# EAGLE design Rx (EAGLE 8.1.1)
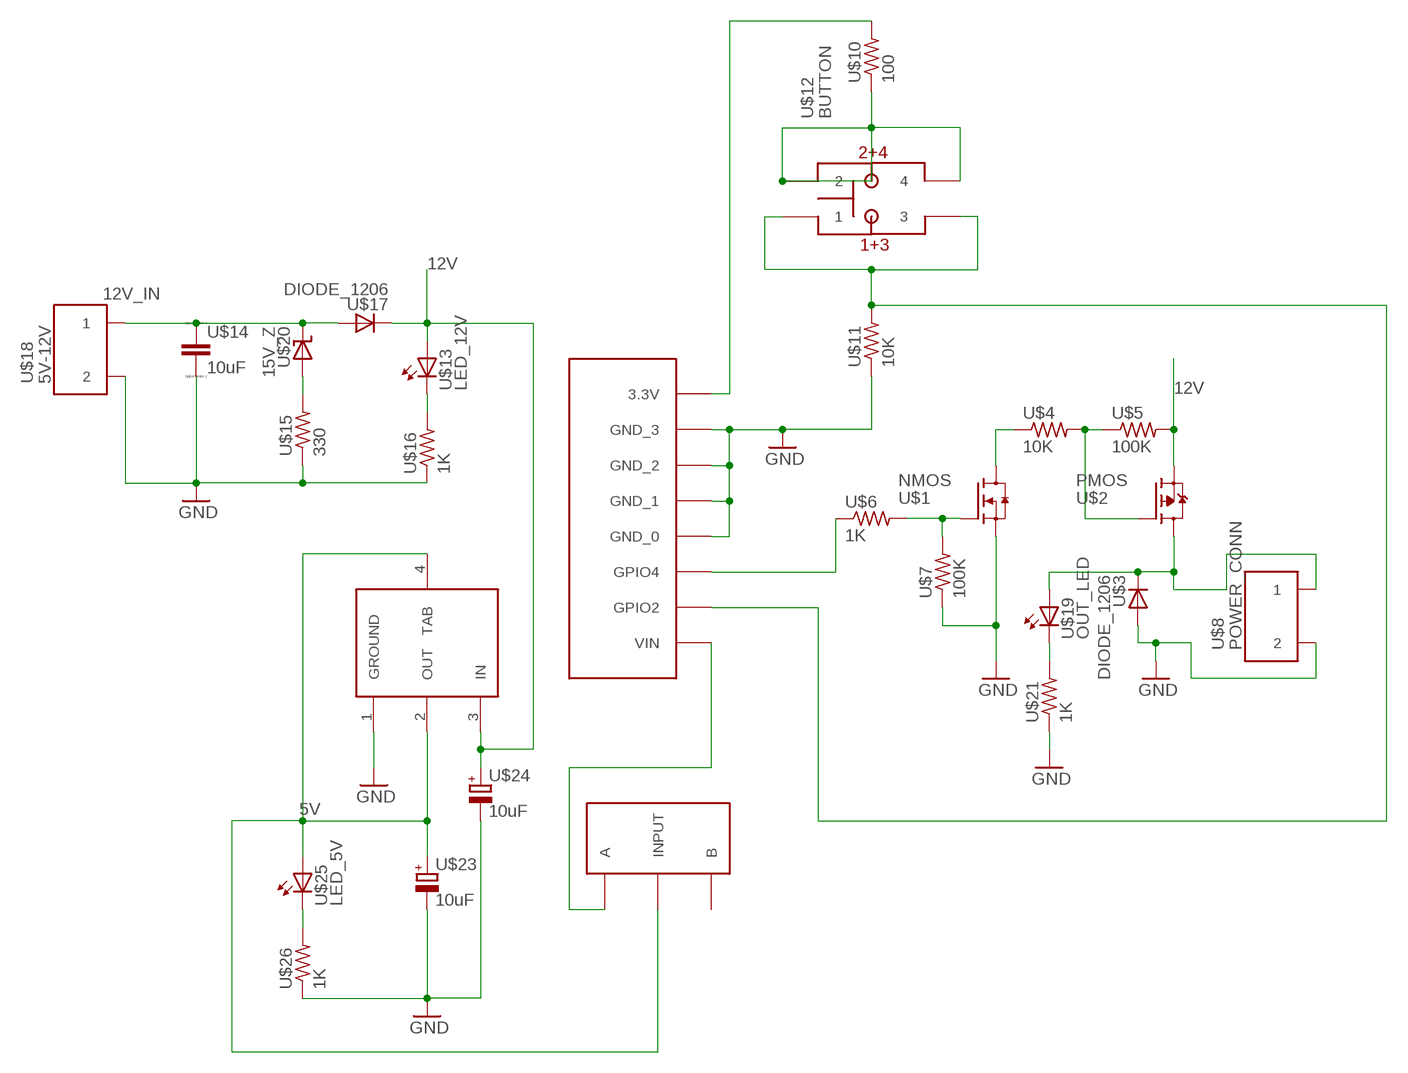
[diagram p0: schematic, sheet 1]

## Parts
U$1  NMOS  [SOT23]
U$2  PMOS  [D-PAK_TO252AA]
U$3  DIODE_1206  [DIDOE_1206]
U$4  10K  RES  [R1206]
U$5  100K  RES  [R1206]
U$6  1K  RES  [R1206]
U$7  100K  RES  [R1206]
U$8  POWER_CONN  [PC_1935161]
U$9  ESP8266  [ESP]
U$10  100  RES  [R1206]
U$11  10K  RES  [R1206]
U$12  BUTTON  [BUTTON]
U$13  LED_12V  LED_1206  [LED_1206]
U$14  10uF  CAP  [C1206]
U$15  330  RES  [R1206]
U$16  1K  RES  [R1206]
U$17  DIODE_1206  [DIDOE_1206]
U$18  5V-12V  POWER_CONN  [PC_1935161]
U$19  OUT_LED  LED_1206  [LED_1206]
U$20  15V_Z  DIODE_Z_1005  [Z_1005]
U$21  1K  RES  [R1206]
U$22  5V_REG  [SOT223]
U$23  10uF  CAP_POL  [153CLV-0405]
U$24  10uF  CAP_POL  [153CLV-0405]
U$25  LED_5V  LED_1206  [LED_1206]
U$26  1K  RES  [R1206]
U$27  SPDT  [SPDT]

## Nets
5V: U$22.2(OUT) U$22.4(TAB) U$23.+ U$25.1(HI) U$27.IN(INPUT)
12V: U$2.3(S) U$5.2 U$13.1(HI) U$17.2(LO) U$22.3(IN) U$24.+
12V_IN: U$14.1 U$17.1(HI) U$18.1 U$20.2(LO)
GND: U$1.2(S) U$3.1(HI) U$7.1 U$8.2 U$9.GND_0 U$9.GND_1 U$9.GND_2 U$9.GND_3 U$11.1 U$14.2 U$15.1 U$16.1 U$18.2 U$21.1 U$22.1(GROUND) U$23.- U$24.- U$26.1
N$1: U$1.1(G) U$6.2 U$7.2
N$2: U$6.1 U$9.GPIO4
N$3: U$1.3(D) U$4.1
N$4: U$2.1(G) U$4.2 U$5.1
N$5: U$19.2(LO) U$21.2
N$6: U$2.4(D) U$3.2(LO) U$8.1 U$19.1(HI)
N$7: U$9.GPIO2 U$11.2 U$12.1 U$12.3
N$8: U$25.2(LO) U$26.2
N$9: U$10.1 U$12.2 U$12.4
N$10: U$9.3.3_1(3.3V) U$10.2
N$11: U$13.2(LO) U$16.2
N$12: U$15.2 U$20.1(HI)
N$13: U$9.VIN U$27.A
Unconnected: U$27.B

## Library data of the parts
U$1 = Gas_Sensor_Lib_v1:NMOS
U$2 = Gas_Sensor_Lib_v1:PMOS
U$3 U$17 = Gas_Sensor_Lib_v1:DIODE_1206
U$4-U$7 U$10 U$11 U$15 U$16 U$21 U$26 = Gas_Sensor_Lib_v1:RES
U$8 U$18 = Gas_Sensor_Lib_v1:POWER_CONN
U$9 = Gas_Sensor_Lib_v1:ESP8266
U$12 = Gas_Sensor_Lib_v1:BUTTON
U$13 U$19 U$25 = Gas_Sensor_Lib_v1:LED_1206
U$14 = Gas_Sensor_Lib_v1:CAP
U$20 = Gas_Sensor_Lib_v1:DIODE_Z_1005
U$22 = Gas_Sensor_Lib_v1:5V_REG
U$23 U$24 = Gas_Sensor_Lib_v1:CAP_POL
U$27 = Gas_Sensor_Lib_v1:SPDT

## Board
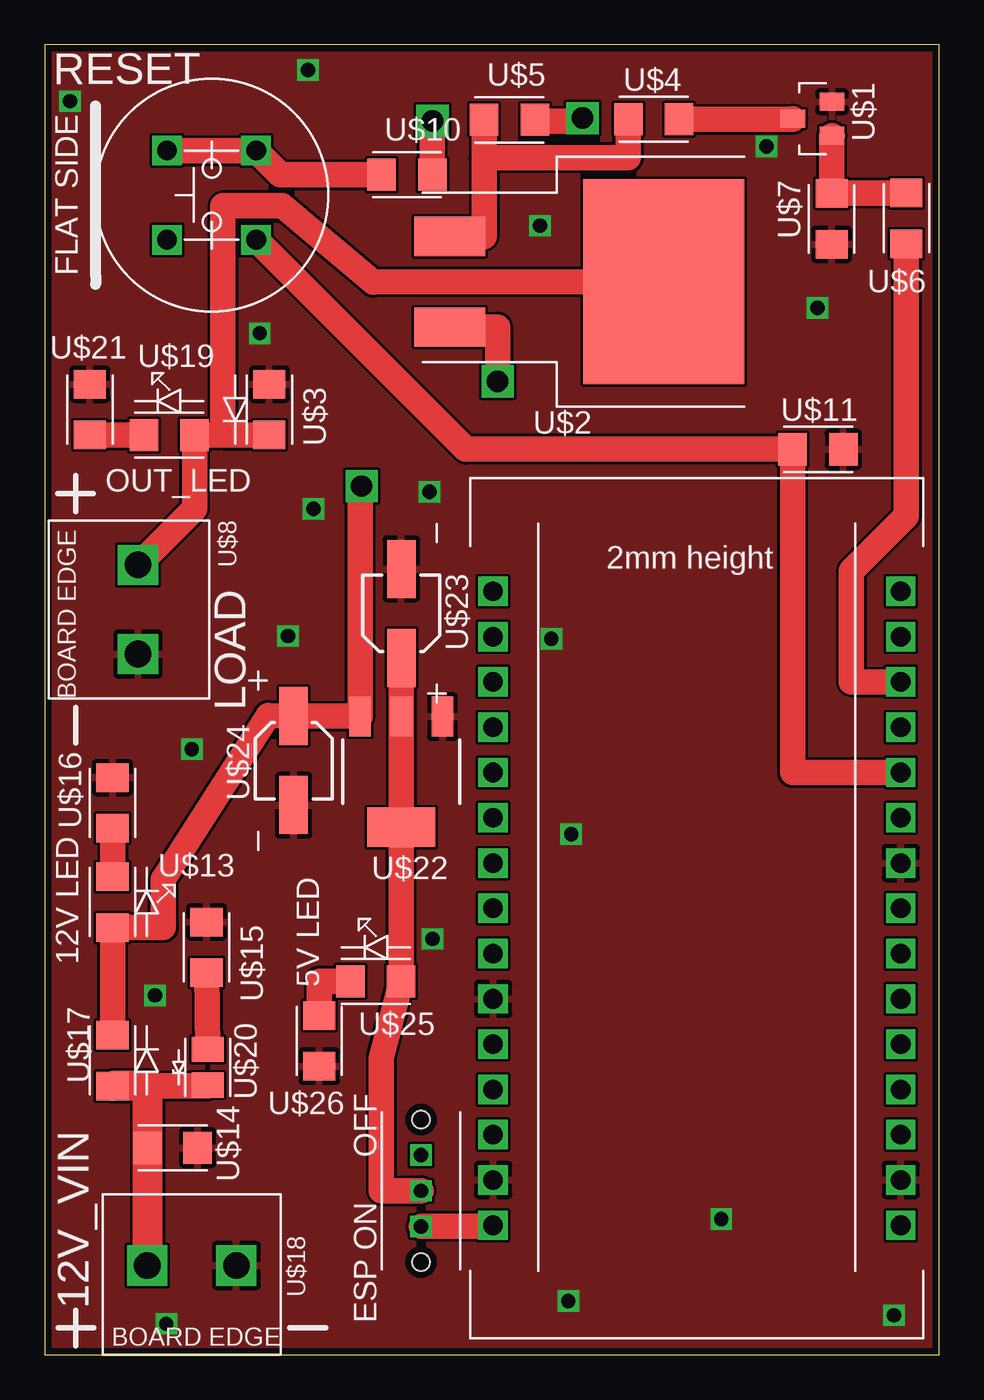
[diagram p1: board, top side]
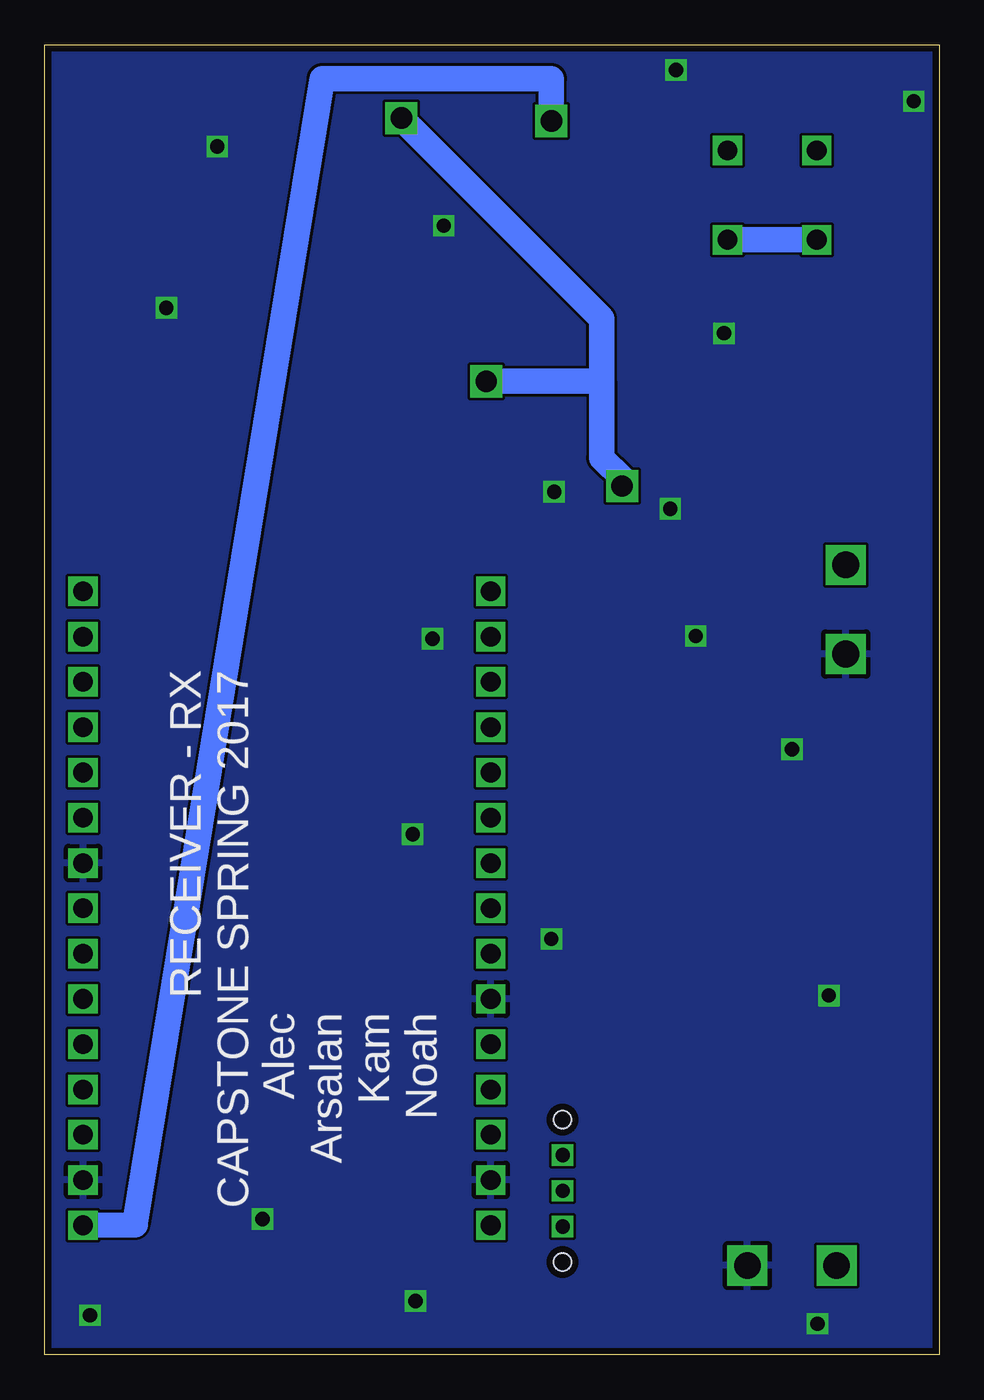
[diagram p2: board, bottom side, seen from below]

Size 50.16 x 73.5 mm. Coordinates in mm from the lower left corner, seen from the top.
Outline: 0,0 50.16,0 50.16,73.5 0,73.5 0,0
Copper layers (1*16): Top 0.0356mm / dielectric 1.5011mm / Bottom 0.0356mm
Design rules "oshpark-2layer": minimum track width 6mil, minimum drill 13mil, track to track 6mil, track to pad 6mil, pad to pad 6mil, via to via 6mil, smd to smd 6mil, copper to edge 15mil, drill to drill 6mil, minimum pad ring 7mil, minimum via ring 7mil, stop-mask expansion 2.5mil, vias tented up to drill 0mil, thermal gap 10mil

### Footprints (pad centres in the part's own frame; a part is rotated, then mirrored left to right if it is on the bottom)
SOT23 = smd 1 x 1.4: 1 -0.95,-1.1; 2 0.95,-1.1; 3 0,1.1
D-PAK_TO252AA = smd 2.2 x 4: 1 -2.54,-7; 3 2.54,-7 | smd 11.5 x 9: 4 0,5
DIDOE_1206 = smd 1.6 x 1.803: 1 -1.422,0; 2 1.422,0
R1206 = smd 1.6 x 1.803: 1 -1.422,0; 2 1.422,0
PC_1935161 = drill 1.5 square: 1 -2.5,0; 2 2.5,0
ESP = drill 1.1 square: 3.3_0 11.43,5.08; 3.3_1 11.43,-17.78; 3.3_2 -11.43,-7.62; GND_0 -11.43,-15.24; GND_1 -11.43,-5.08; GND_2 11.43,2.54; GND_3 11.43,-15.24; GPIO2 11.43,7.62; GPIO4 11.43,12.7; P$2 -11.43,0; P$3 -11.43,2.54; P$4 -11.43,5.08; P$5 -11.43,7.62; P$6 -11.43,10.16; P$7 -11.43,12.7; P$8 -11.43,15.24; P$9 -11.43,17.78; P$10 11.43,0; P$14 11.43,10.16; P$16 11.43,15.24; P$17 11.43,17.78; P$19 -11.43,-12.7; P$20 -11.43,-10.16; P$23 -11.43,-2.54; P$26 11.43,-12.7; P$27 11.43,-10.16; P$28 11.43,-7.62; P$29 11.43,-5.08; P$30 11.43,-2.54; VIN -11.43,-17.78
BUTTON = drill 1.1 square: 1 -2.5,2.5; 2 2.5,2.5; 3 -2.5,-2.5; 4 2.5,-2.5
LED_1206 = smd 1.6 x 1.803: 1 -1.422,0; 2 1.422,0
C1206 = smd 1.6 x 1.8: 1 -1.4,0; 2 1.4,0
Z_1005 = smd 1.4 x 1.8: 1 -1,0; 2 1,0
SOT223 = smd 1.219 x 2.235: 1 -2.311,-3.099; 2 0,-3.099; 3 2.311,-3.099 | smd 3.8 x 2.2: 4 0,3.099
153CLV-0405 = smd 3.25 x 1.6: + 2.5,0; - -2.5,0
SPDT = drill 0.8 square: A -2,0; B 2,0; IN 0,0 | hole 1: -4,0; 4,0

### Placement (x,y rotation side)
U$1  43.05,69.34 90 top
U$2  29.72,60.2 270 top
U$3  12.6,53.02 270 top
U$4  34.16,69.31 180 top
U$5  26.07,69.28 0 top
U$6  48.32,63.75 90 top
U$7  44.13,63.72 90 top
U$8  5.24,41.81 270 top
U$9  36.58,25.05 0 top
U$10  20.32,66.2 0 top
U$11  43.37,50.8 180 top
U$12  9.37,65.06 90 top
U$13  3.81,25.4 90 top
U$14  7.18,11.62 0 top
U$15  9.08,22.86 270 top
U$16  3.81,30.96 270 top
U$17  3.81,16.51 90 top
U$18  8.26,5.02 0 top
U$19  6.99,51.59 180 top
U$20  9.14,16.13 270 top
U$21  2.54,53.02 270 top
U$22  20,32.7 180 top
U$23  20,41.59 270 top
U$24  13.97,33.34 90 top
U$25  18.57,20.95 180 top
U$26  15.4,17.62 90 top
U$27  21.11,9.21 90 top

### Tracks (layer width: path | path; a pad name or v marks a point on that pad's centre or on a via)
5V
  Top 1.422: U$27.IN 18.89,9.21 18.89,16.67 U$25.1 U$22.4 U$22.2 U$23.+
12V  (via drill 1.2)
  Top 1.422: U$17.2 U$13.1 6.67,23.98 6.67,26.67 12.54,35.88 U$24.+ 17.69,35.84 U$22.3 17.69,48.74 v17.78,48.74 | U$5.2 27.49,69.22 30.16,69.22 v30.16,69.37 | U$2.3 25.4,57.66 v25.4,54.61
  Bottom 1.422: v17.78,48.74 17.78,49.17 18.93,50.32 18.93,54.45 | v30.16,69.37 18.93,58.14 18.93,54.45 | v25.4,54.61 18.93,54.61 18.93,54.45
12V_IN
  Top 1.422: U$17.1 9.14,15.09 U$20.2
  Top 1.676: U$18.1 5.78,5.02 U$14.1 5.78,15.09 U$17.1
GND  (via drill 0.8)
  other vias: 28.42,40.16 47.62,2.22 29.53,29.21 21.75,23.34 37.94,7.62 29.37,3.02 15.08,47.47 6.83,1.75 6.19,20.16 8.26,33.97 13.65,40.32 12.06,57.31 21.59,48.42 43.34,58.74 1.43,70.33 14.76,72.07 40.48,67.79 27.78,63.34
  pour Top: 0.16,73.34 50.07,73.34 50.07,0.32 0,0
  pour Bottom: 0.16,73.34 50.01,73.41 50.01,0.38 0,0
N$1
  Top 1.422: U$1.1 44.13,68.39 U$7.2 44.13,65.18 U$6.2
N$2
  Top 1.422: U$6.1 48.32,47.05 45.24,43.97 45.24,37.75 U$9.GPIO4
N$3
  Top 1.422: U$4.1 41.95,69.31 U$1.3
N$4
  Top 1.422: U$4.2 32.74,67.15 24.64,67.15 | U$5.1 24.64,67.15 | 24.64,67.15 24.64,62.74 U$2.1
N$5
  Top 1.422: U$19.2 U$21.2
N$6
  Top 1.422: 10,51.6 U$3.2 | 10,51.6 U$19.1 8.41,47.48 U$8.1 | U$2.4 18.41,60.17 13.34,64.45 10,64.45 10,51.6
N$7
  Top 1.422: U$9.GPIO2 41.95,32.67 U$11.2 23.62,50.8 U$12.3
  Bottom 1.422: U$12.1 U$12.3
N$8
  Top 1.422: U$25.2 15.4,20.95 U$26.2
N$9
  Top 1.422: U$12.2 U$12.4 13.22,66.2 U$10.1
N$10  (via drill 1.2)
  Top 1.422: U$10.2 v21.74,69.22 v21.75,69.22
  Bottom 1.422: v21.75,69.22 21.75,71.6 34.61,71.6 45.09,7.46 45.09,7.3 U$9.3.3_1
N$11
  Top 1.422: U$16.2 U$13.2
N$12
  Top 1.422: U$15.2 U$20.1
N$13
  Top 1.422: U$9.VIN 25.15,7.21 U$27.A

### Text on the board
tPlace: RESET | OUT_LED | LOAD | 12V LED | 5V LED | 12V_VIN
bPlace: RECEIVER - RX / CAPSTONE SPRING 2017 | Alec / Arsalan / Kam / Noah